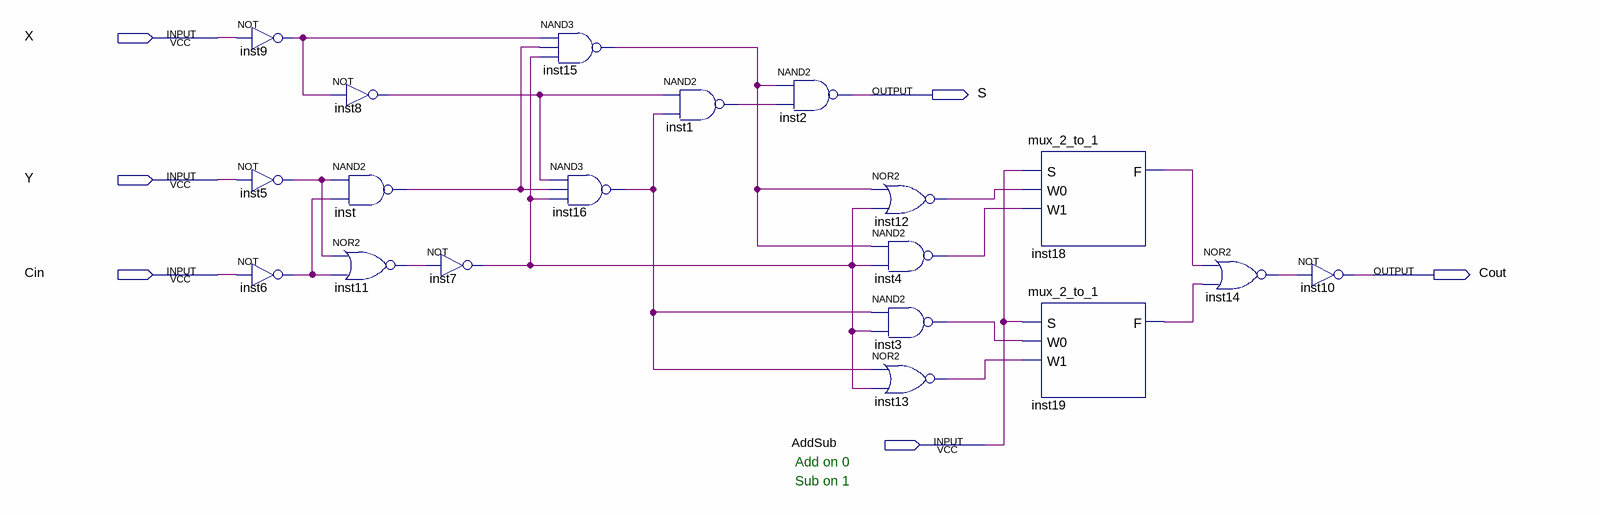
[diagram p0: schematic sheet]
// Quartus schematic AdderSubtractor.bdf as structural Verilog: 19 symbols, 6 pins
module AdderSubtractor (
  input  X,
  input  Y,
  input  Cin,
  input  AddSub,
  output S,
  output Cout
);

  wire inst1_out, inst3_out, inst4_out, inst5_out, inst6_out, inst7_out, inst8_out, inst9_out, inst11_out,
       inst12_out, inst13_out, inst14_out, inst15_out, inst16_out, inst18_f, inst19_f, inst_out;

  not inst9 (inst9_out, X);
  not inst5 (inst5_out, Y);
  not inst6 (inst6_out, Cin);
  not inst8 (inst8_out, inst9_out);
  nand inst (inst_out, inst5_out, inst6_out);
  nor inst11 (inst11_out, inst5_out, inst6_out);
  not inst7 (inst7_out, inst11_out);
  nand inst15 (inst15_out, inst9_out, inst_out, inst7_out);
  nand inst16 (inst16_out, inst8_out, inst_out, inst7_out);
  nand inst1 (inst1_out, inst8_out, inst16_out);
  nand inst2 (S, inst15_out, inst1_out);
  nor inst12 (inst12_out, inst15_out, inst7_out);
  nand inst4 (inst4_out, inst15_out, inst7_out);
  nand inst3 (inst3_out, inst16_out, inst7_out);
  nor inst13 (inst13_out, inst16_out, inst7_out);
  mux_2_to_1 inst18 (.S(AddSub), .W0(inst12_out), .W1(inst4_out), .F(inst18_f));
  mux_2_to_1 inst19 (.S(AddSub), .W0(inst3_out), .W1(inst13_out), .F(inst19_f));
  nor inst14 (inst14_out, inst18_f, inst19_f);
  not inst10 (Cout, inst14_out);

  // Notes on the sheet:
  //   Add on 0
  //   Sub on 1
endmodule
